# EAGLE schematic linefollower (EAGLE 9.3.0)
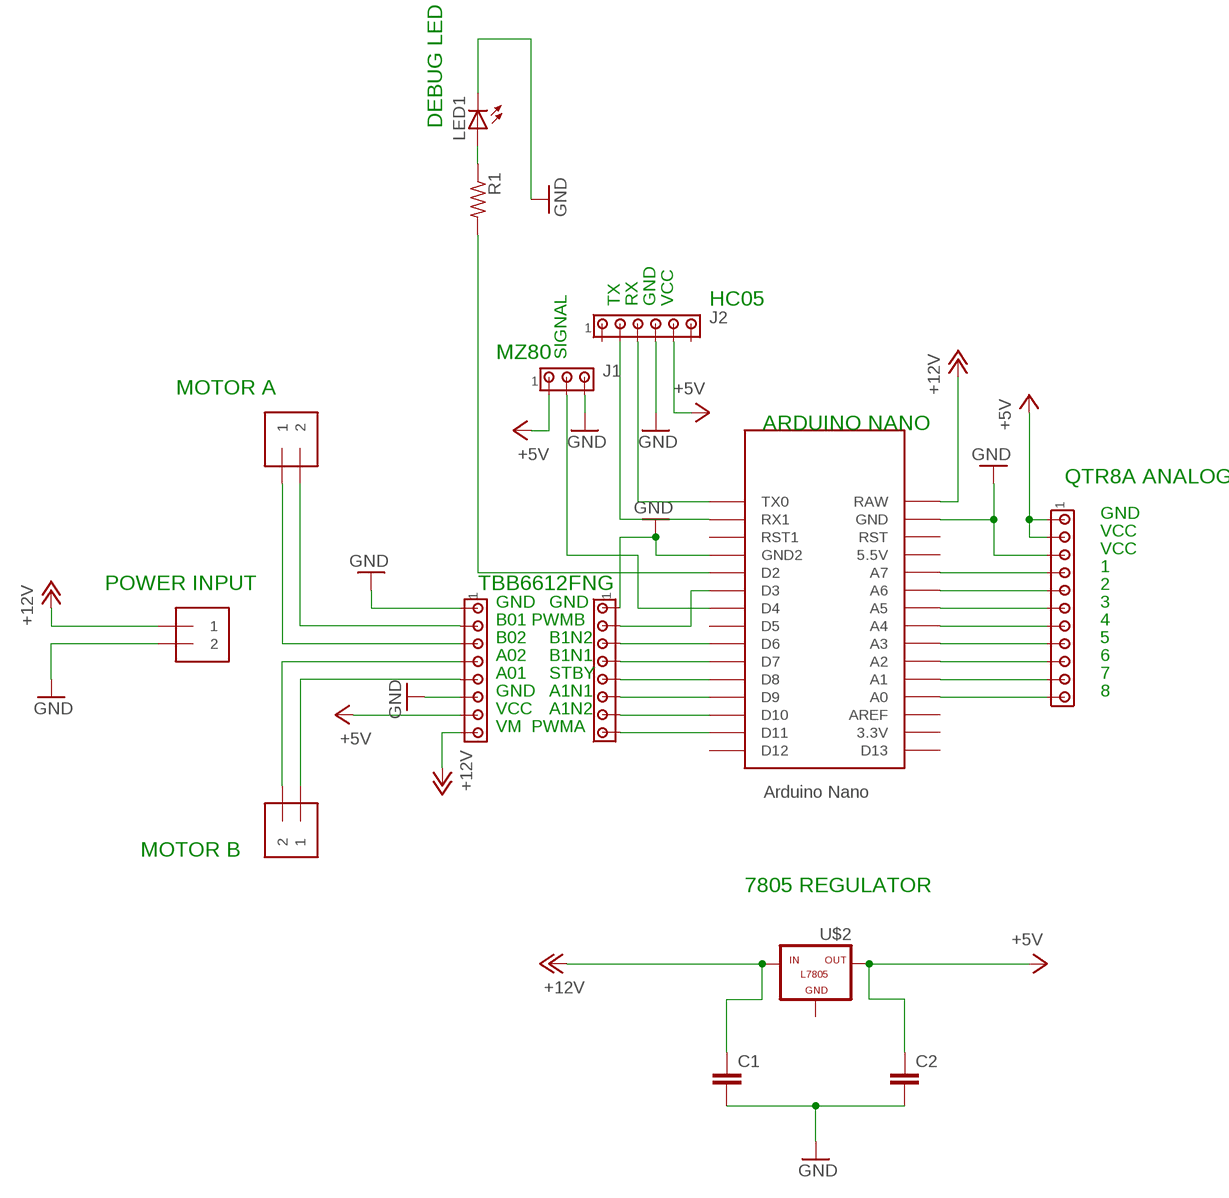
[diagram p0: schematic, sheet 1]

## Parts
C1  C-EUC0805  [C0805]
C2  C-EUC0805  [C0805]
J1  MTA03-100  [10X03MTA]
J2  MTA06-100  [10X06MTA]
LED1  LED-0805  [LED-805]
MOTORA  1X2-3.5MM  [3.5MMTERM]
MOTORB  1X2-3.5MM  [3.5MMTERM]
POWER  1X2-3.5MM  [3.5MMTERM]
QTR8A  MTA11-156  [1X11MTA]
R1  R-US_R0805  [R0805]
TBB6612FNGLEFT  MTA08-100  [10X08MTA]
TBB6612FNGRıGHT  MTA08-100  [10X08MTA]
U$1  NANO  [NANO]
U$2  -L7805  [L7805]

## Nets
+5V: C2.1 J1.1 J2.5 QTR8A.1 QTR8A.2 TBB6612FNGLEFT.7 U$2.OUT
+12V: C1.1 POWER.1 TBB6612FNGLEFT.8 U$1.RAW U$2.IN
AIN1: TBB6612FNGRıGHT.6 U$1.D9
AIN2: TBB6612FNGRıGHT.7 U$1.D10
AO1: MOTORB.1 TBB6612FNGLEFT.5
AO2: MOTORB.2 TBB6612FNGLEFT.4
B1N1: TBB6612FNGRıGHT.4 U$1.D7
B1N2: TBB6612FNGRıGHT.3 U$1.D6
BO1: MOTORA.2 TBB6612FNGLEFT.2
BO2: MOTORA.1 TBB6612FNGLEFT.3
GND: C1.2 C2.2 J1.3 J2.4 LED1.C POWER.2 QTR8A.3 TBB6612FNGLEFT.1 TBB6612FNGLEFT.6 TBB6612FNGRıGHT.1 U$1.GND U$1.GND1(GND2)
N$1: QTR8A.4 U$1.A7
N$2: QTR8A.5 U$1.A6
N$3: QTR8A.6 U$1.A5
N$4: QTR8A.7 U$1.A4
N$5: QTR8A.8 U$1.A3
N$6: QTR8A.9 U$1.A2
N$7: QTR8A.10 U$1.A1
N$8: QTR8A.11 U$1.A0
N$9: R1.2 U$1.D2
N$10: J1.2 U$1.D4
N$62: J2.2 U$1.RX1
N$63: J2.3 U$1.TX0
N$69: LED1.A R1.1
PMWA: TBB6612FNGRıGHT.8 U$1.D11
PWMB: TBB6612FNGRıGHT.2 U$1.D3
STBY: TBB6612FNGRıGHT.5 U$1.D8
Unconnected: J2.1 J2.6 U$1.3.3V U$1.5V(5.5V) U$1.AREF U$1.D5 U$1.D12 U$1.D13 U$1.ICSP1 U$1.ICSP2 U$1.ICSP3 U$1.ICSP4 U$1.ICSP5 U$1.ICSP6 U$1.RST U$1.RST1 U$2.GND

## Notes on the sheet
- DEBUG LED
- TX | RX | GND | VCC | HC05
- MZ80 | SIGNAL
- MOTOR A
- ARDUINO NANO
- QTR8A ANALOG
- GND
- VCC
- VCC
- 1
- POWER INPUT | TBB6612FNG | 2
- GND | GND | 3
- B01 | PWMB | 4
- B02 | B1N2 | 5
- A02 | B1N1 | 6
- A01 | STBY | 7
- GND | A1N1 | 8
- VCC | A1N2
- VM | PWMA
- MOTOR B
- 7805 REGULATOR

## Library data of the parts
C1 C2 = rcl:C-EU: CAPACITOR, European symbol; SPICEPREFIX: C
J1 = con-amp:MTA03-100: AMP connector
J2 = con-amp:MTA06-100: AMP connector Connection corrected 2014-09-19
LED1 = dp_devices.v6:LED: Light Emitting Diode
MOTORA MOTORB POWER = adafruit:1X2: 3.5mm Terminal block http://www.ladyada.net/library/pcb/eaglelibrary.html
QTR8A = con-amp:MTA11-156: AMP connector
R1 = adafruit:R-US_: RESISTOR, American symbol
TBB6612FNGLEFT TBB6612FNGRıGHT = con-amp:MTA08-100: AMP connector
U$1 = Arduino-clone:NANO: Arduino Nano
U$2 = tango:-L7805